# EAGLE schematic hub-carrier-p4 (EAGLE 7.7.0)
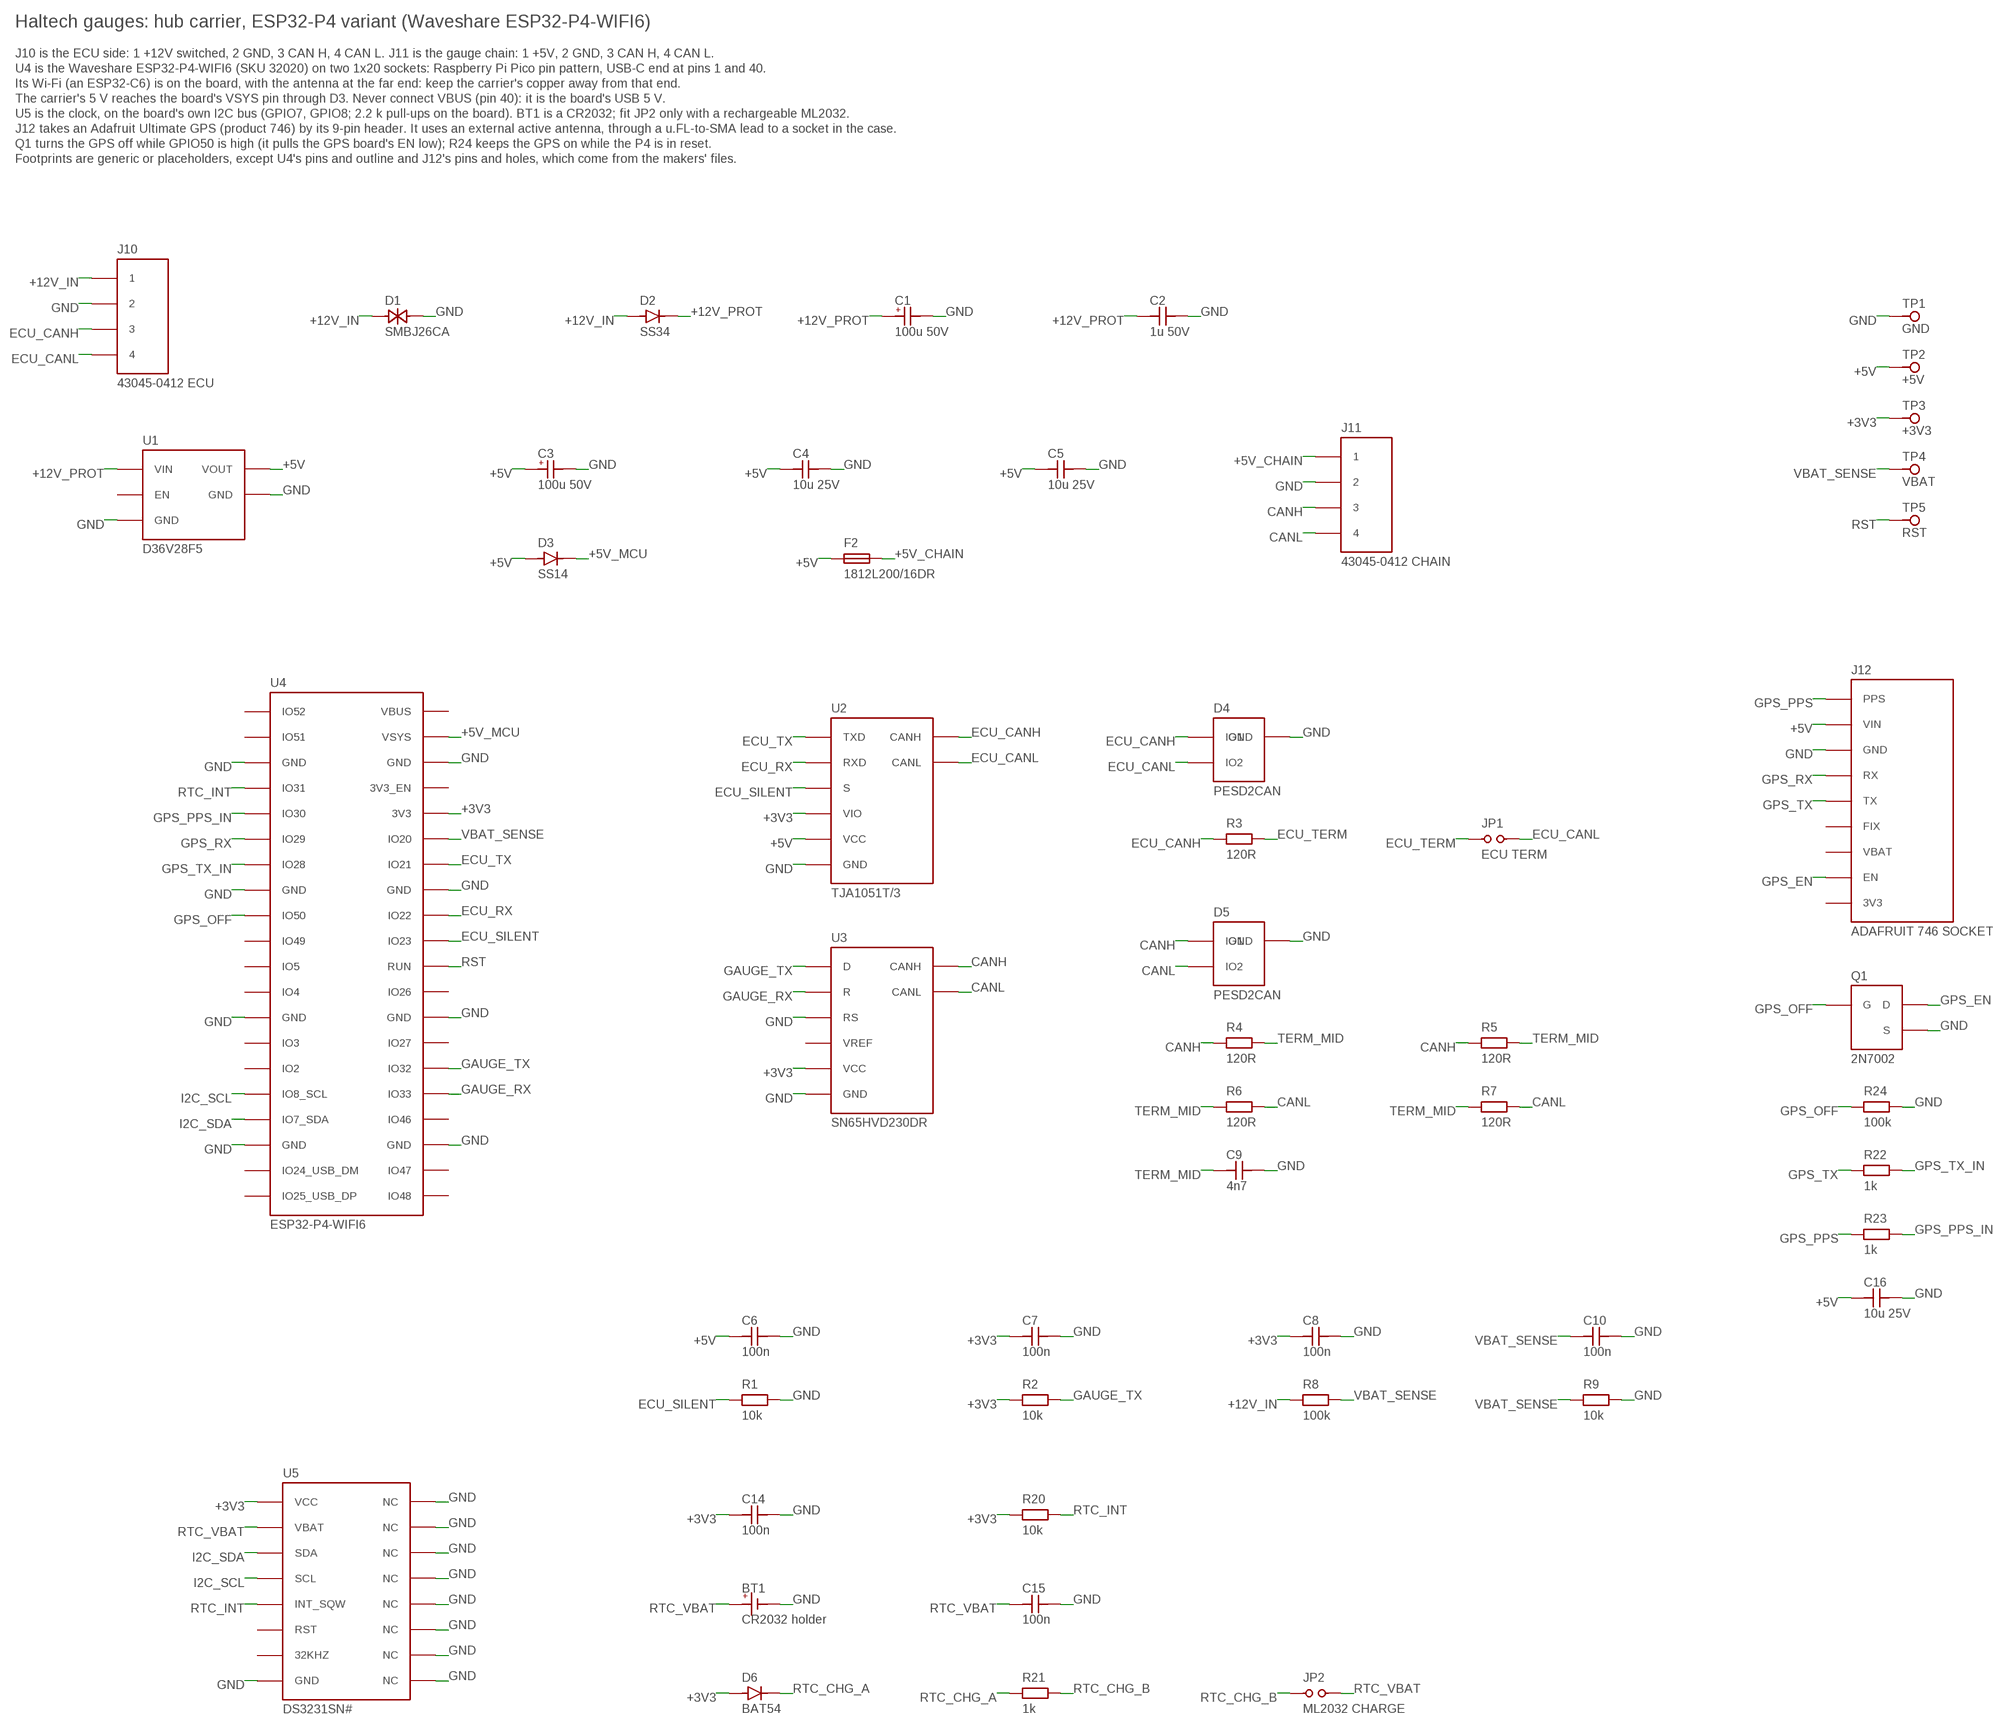
[diagram p0: schematic, sheet 1]

## Parts
BT1  CR2032 holder  BATTERY-2032  [CR2032-HOLDER-PLACEHOLDER]
C1  100u 50V  CPOL-8X10  [CAP-SMD-8X10]
C2  1u 50V  C0805  [0805]
C3  100u 50V  CPOL-8X10  [CAP-SMD-8X10]
C4  10u 25V  C0805  [0805]
C5  10u 25V  C0805  [0805]
C6  100n  C0805  [0805]
C7  100n  C0805  [0805]
C8  100n  C0805  [0805]
C9  4n7  C0805  [0805]
C10  100n  C0805  [0805]
C14  100n  C0805  [0805]
C15  100n  C0805  [0805]
C16  10u 25V  C0805  [0805]
D1  SMBJ26CA  TVS-SMB  [SMB]
D2  SS34  SCHOTTKY-SMA  [SMA]
D3  SS14  SCHOTTKY-SMA  [SMA]
D4  PESD2CAN  [SOT23]
D5  PESD2CAN  [SOT23]
D6  BAT54  [SOT23]
F2  1812L200/16DR  POLYFUSE-1812  [1812]
J10  43045-0412 ECU  MICROFIT-2X2  [MOLEX-43045-0412]
J11  43045-0412 CHAIN  MICROFIT-2X2  [MOLEX-43045-0412]
J12  ADAFRUIT 746 SOCKET  ADAFRUIT-ULTIMATE-GPS  [ADAFRUIT-ULTIMATE-GPS]
JP1  ECU TERM  JUMPER-2  [HDR-1X2]
JP2  ML2032 CHARGE  JUMPER-2  [HDR-1X2]
Q1  2N7002  [SOT23]
R1  10k  R0805  [0805]
R2  10k  R0805  [0805]
R3  120R  R1206  [1206]
R4  120R  R1206  [1206]
R5  120R  R1206  [1206]
R6  120R  R1206  [1206]
R7  120R  R1206  [1206]
R8  100k  R0805  [0805]
R9  10k  R0805  [0805]
R20  10k  R0805  [0805]
R21  1k  R0805  [0805]
R22  1k  R0805  [0805]
R23  1k  R0805  [0805]
R24  100k  R0805  [0805]
TP1  GND  TESTPOINT  [TESTPAD]
TP2  +5V  TESTPOINT  [TESTPAD]
TP3  +3V3  TESTPOINT  [TESTPAD]
TP4  VBAT  TESTPOINT  [TESTPAD]
TP5  RST  TESTPOINT  [TESTPAD]
U1  D36V28F5  POLOLU-D36V28F5  [POLOLU-D36V28F-PLACEHOLDER]
U2  TJA1051T/3  TJA1051T-3  [SOIC8]
U3  SN65HVD230DR  SN65HVD230  [SOIC8]
U4  ESP32-P4-WIFI6  WAVESHARE-ESP32-P4-WIFI6  [WAVESHARE-ESP32-P4-WIFI6]
U5  DS3231SN#  DS3231SN  [SOIC16W]

## Nets
+3V3: C7.1 C8.1 C14.1 D6.1(A) R2.1 R20.1 TP3.1(TP) U2.5(VIO) U3.3(VCC) U4.36(3V3) U5.2(VCC)
+5V: C3.1(+) C4.1 C5.1 C6.1 C16.1 D3.2(A) F2.1 J12.2(VIN) TP2.1(TP) U1.VOUT U2.3(VCC)
+5V_CHAIN: F2.2 J11.1
+5V_MCU: D3.1(K) U4.39(VSYS)
+12V_IN: D1.1 D2.2(A) J10.1 R8.1
+12V_PROT: C1.1(+) C2.1 D2.1(K) U1.VIN
CANH: D5.1(IO1) J11.3 R4.1 R5.1 U3.7(CANH)
CANL: D5.2(IO2) J11.4 R6.2 R7.2 U3.6(CANL)
ECU_CANH: D4.1(IO1) J10.3 R3.1 U2.7(CANH)
ECU_CANL: D4.2(IO2) J10.4 JP1.2 U2.6(CANL)
ECU_RX: U2.4(RXD) U4.32(IO22)
ECU_SILENT: R1.1 U2.8(S) U4.31(IO23)
ECU_TERM: JP1.1 R3.2
ECU_TX: U2.1(TXD) U4.34(IO21)
GAUGE_RX: U3.4(R) U4.25(IO33)
GAUGE_TX: R2.2 U3.1(D) U4.26(IO32)
GND: BT1.NEG(-) C1.2(-) C2.2 C3.2(-) C4.2 C5.2 C6.2 C7.2 C8.2 C9.2 C10.2 C14.2 C15.2 C16.2 D1.2 D4.3(GND) D5.3(GND) J10.2 J11.2 J12.3(GND) Q1.2(S) R1.2 R9.2 R24.2 TP1.1(TP) U1.GND1(GND) U1.GND2(GND) U2.2(GND) U3.2(GND) U3.8(RS) U4.3(GND) U4.8(GND) U4.13(GND) U4.18(GND) U4.23(GND) U4.28(GND) U4.33(GND) U4.38(GND) U5.5(NC) U5.6(NC) U5.7(NC) U5.8(NC) U5.9(NC) U5.10(NC) U5.11(NC) U5.12(NC) U5.13(GND)
GPS_EN: J12.8(EN) Q1.3(D)
GPS_OFF: Q1.1(G) R24.1 U4.9(IO50)
GPS_PPS: J12.1(PPS) R23.1
GPS_PPS_IN: R23.2 U4.5(IO30)
GPS_RX: J12.4(RX) U4.6(IO29)
GPS_TX: J12.5(TX) R22.1
GPS_TX_IN: R22.2 U4.7(IO28)
I2C_SCL: U4.16(IO8_SCL) U5.16(SCL)
I2C_SDA: U4.17(IO7_SDA) U5.15(SDA)
RST: TP5.1(TP) U4.30(RUN)
RTC_CHG_A: D6.3(K) R21.1
RTC_CHG_B: JP2.1 R21.2
RTC_INT: R20.2 U4.4(IO31) U5.3(INT_SQW)
RTC_VBAT: BT1.POS(+) C15.1 JP2.2 U5.14(VBAT)
TERM_MID: C9.1 R4.2 R5.2 R6.1 R7.1
VBAT_SENSE: C10.1 R8.2 R9.1 TP4.1(TP) U4.35(IO20)
Unconnected: J12.6(FIX) J12.7(VBAT) J12.9(3V3) U1.EN U3.5(VREF) U4.1(IO52) U4.2(IO51) U4.10(IO49) U4.11(IO5) U4.12(IO4) U4.14(IO3) U4.15(IO2) U4.19(IO24_USB_DM) U4.20(IO25_USB_DP) U4.21(IO48) U4.22(IO47) U4.24(IO46) U4.27(IO27) U4.29(IO26) U4.37(3V3_EN) U4.40(VBUS) U5.1(32KHZ) U5.4(RST)

## Notes on the sheet
- Haltech gauges: hub carrier, ESP32-P4 variant (Waveshare ESP32-P4-WIFI6)
- J10 is the ECU side: 1 +12V switched, 2 GND, 3 CAN H, 4 CAN L. J11 is the gauge chain: 1 +5V, 2 GND, 3 CAN H, 4 CAN L.
- U4 is the Waveshare ESP32-P4-WIFI6 (SKU 32020) on two 1x20 sockets: Raspberry Pi Pico pin pattern, USB-C end at pins 1 and 40.
- Its Wi-Fi (an ESP32-C6) is on the board, with the antenna at the far end: keep the carrier's copper away from that end.
- The carrier's 5 V reaches the board's VSYS pin through D3. Never connect VBUS (pin 40): it is the board's USB 5 V.
- U5 is the clock, on the board's own I2C bus (GPIO7, GPIO8; 2.2 k pull-ups on the board). BT1 is a CR2032; fit JP2 only with a rechargeable ML2032.
- J12 takes an Adafruit Ultimate GPS (product 746) by its 9-pin header. It uses an external active antenna, through a u.FL-to-SMA lead to a socket in the case.
- Q1 turns the GPS off while GPIO50 is high (it pulls the GPS board's EN low); R24 keeps the GPS on while the P4 is in reset.
- Footprints are generic or placeholders, except U4's pins and outline and J12's pins and holes, which come from the makers' files.

## Library data of the parts
BT1 = haltech-gauges:BATTERY-2032
C1 C3 = haltech-gauges:CPOL-8X10; LCSC: C116241
C2 = haltech-gauges:C0805; LCSC: C28323
C4 C5 C16 = haltech-gauges:C0805; LCSC: C15850
C6-C8 C10 C14 C15 = haltech-gauges:C0805; LCSC: C49678
C9 = haltech-gauges:C0805; LCSC: C1744
D1 = haltech-gauges:TVS-SMB; LCSC: C515606
D2 = haltech-gauges:SCHOTTKY-SMA; LCSC: C8678
D3 = haltech-gauges:SCHOTTKY-SMA; LCSC: C2480
D4 D5 = haltech-gauges:PESD2CAN; LCSC: C75176
D6 = haltech-gauges:BAT54; LCSC: C8590
F2 = haltech-gauges:POLYFUSE-1812; LCSC: C439873
J10 J11 = haltech-gauges:MICROFIT-2X2
J12 = haltech-gauges:ADAFRUIT-ULTIMATE-GPS
JP1 JP2 = haltech-gauges:JUMPER-2
Q1 = haltech-gauges:2N7002; LCSC: C8545
R1 R2 R9 R20 = haltech-gauges:R0805; LCSC: C17414
R3-R7 = haltech-gauges:R1206; LCSC: C17909
R8 R24 = haltech-gauges:R0805; LCSC: C149504
R21-R23 = haltech-gauges:R0805; LCSC: C17513
TP1-TP5 = haltech-gauges:TESTPOINT
U1 = haltech-gauges:POLOLU-D36V28F5
U2 = haltech-gauges:TJA1051T-3; LCSC: C38695
U3 = haltech-gauges:SN65HVD230; LCSC: C12084
U4 = haltech-gauges:WAVESHARE-ESP32-P4-WIFI6
U5 = haltech-gauges:DS3231SN; LCSC: C9866